# EAGLE schematic Druckluftelektrik (EAGLE 6.5.0)
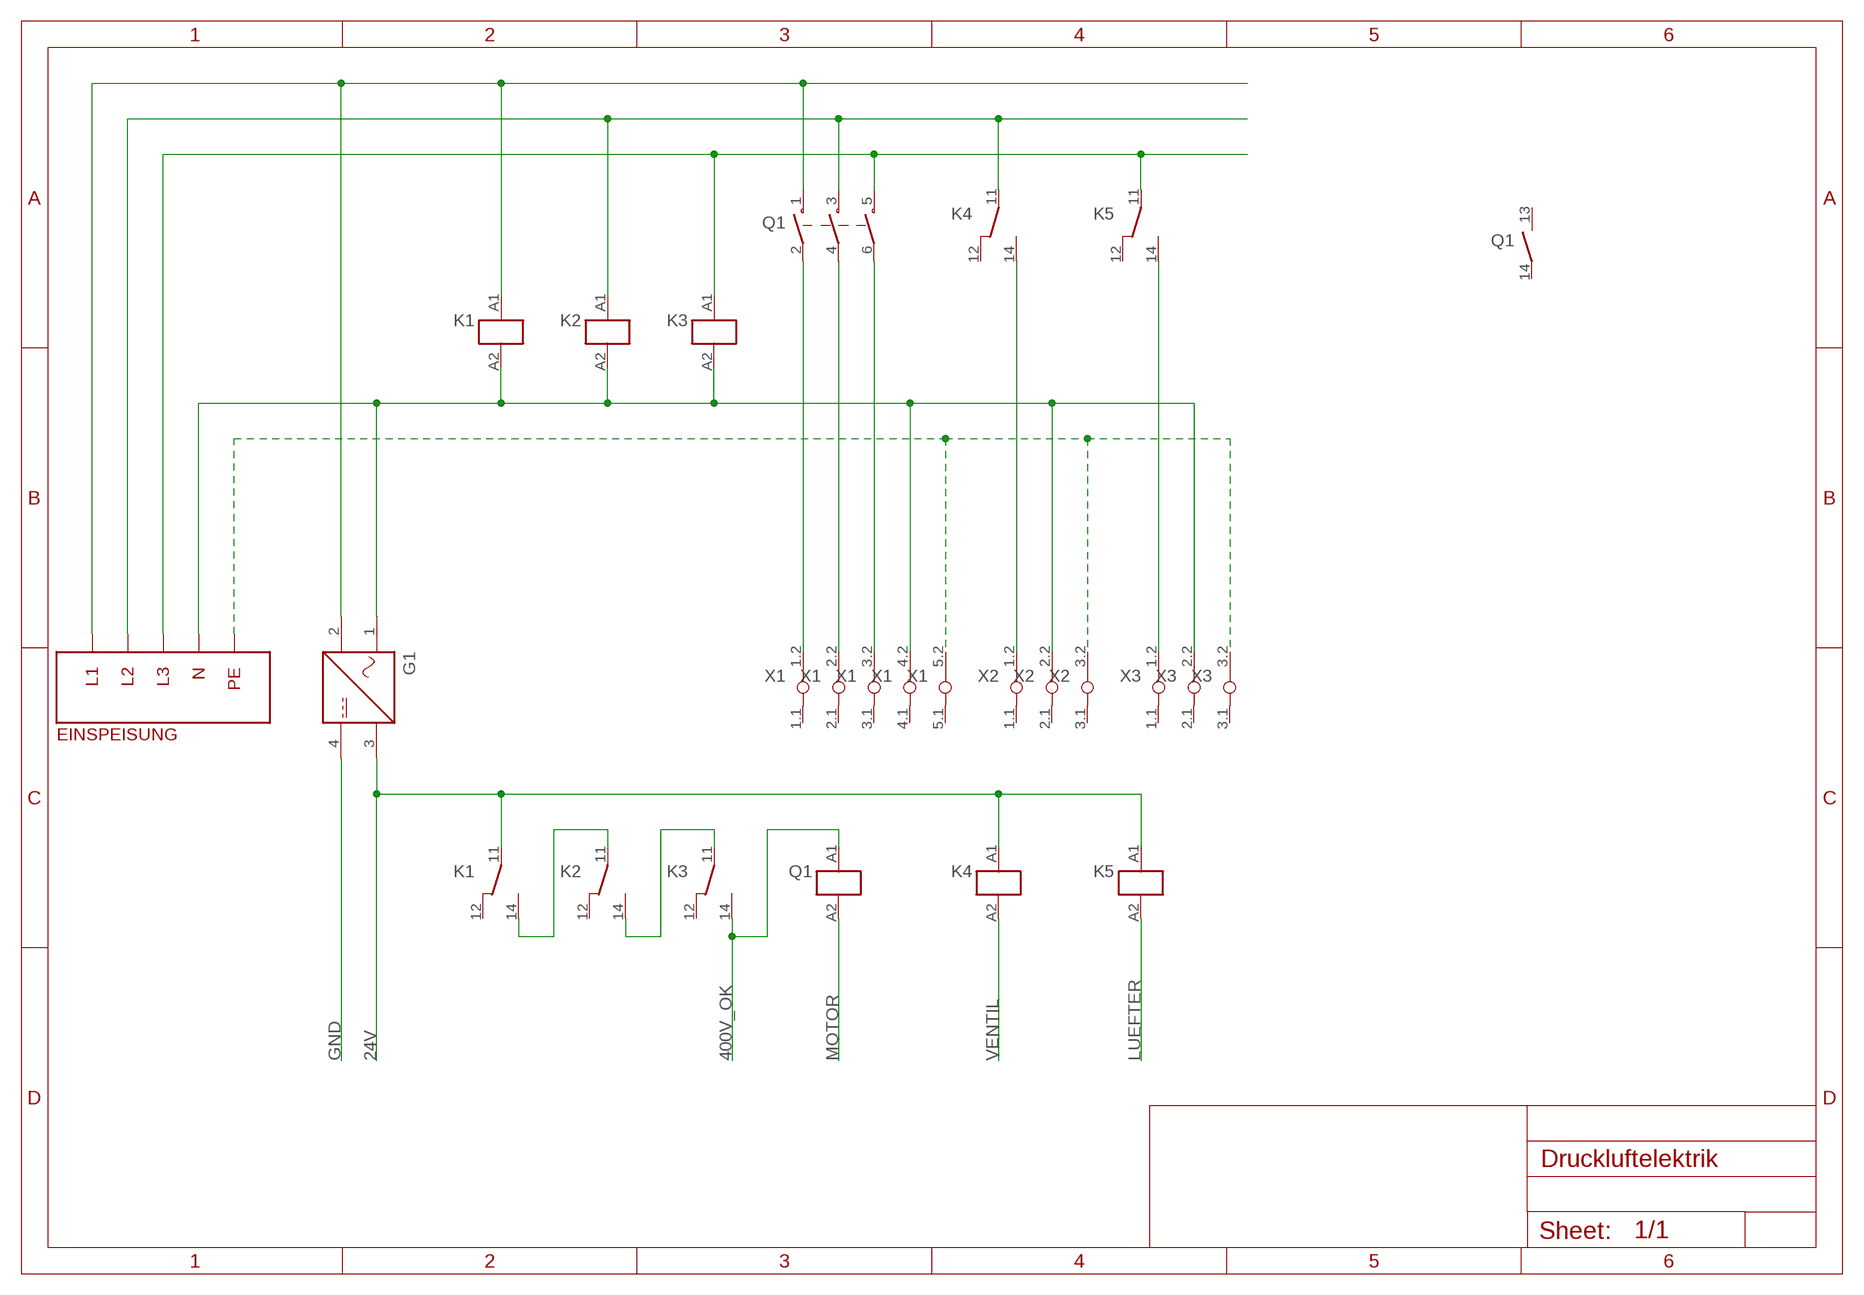
[diagram p0: schematic, sheet 1]

## Parts
G1  NETZTEIL_GLEICHSPANNUNG  [NETZTEIL_GLEICHSPANNUNG]
K1  HILFSSCHUETZ_11-12-14  [HILFSSCHUETZ_11-12-14]
K2  HILFSSCHUETZ_11-12-14  [HILFSSCHUETZ_11-12-14]
K3  HILFSSCHUETZ_11-12-14  [HILFSSCHUETZ_11-12-14]
K4  HILFSSCHUETZ_11-12-14  [HILFSSCHUETZ_11-12-14]
K5  HILFSSCHUETZ_11-12-14  [HILFSSCHUETZ_11-12-14]
Q1  HAUPTSCHUETZ_3-POL_HILFSKONTAKT_13-14  [HAUPTSCHUETZ_3-POL+HILFSKONTAKT_13-14]
X1  KLEMME_1-5  [KLEMME_1-5]
X2  KLEMME_1-3  [KLEMME_1-3]
X3  KLEMME_1-3  [KLEMME_1-3]

## Nets
24V: G1.3 K1.11 K4.A1(0:A1) K5.A1(0:A1)
400V_OK: K3.14 Q1.A1(1:A1)
GND: G1.4
L1-EXT: G1.2 K1.A1(0:A1) Q1.1
L2-EXT: K2.A1(0:A1) K4.11 Q1.3
L3-EXT: K3.A1(0:A1) K5.11 Q1.5
LUEFTER: K5.A2(0:A2)
MOTOR: Q1.A2(1:A2)
N$1: Q1.2 X1.1.2(1:1.2)
N$2: Q1.4 X1.2.2(2:2.2)
N$3: Q1.6 X1.3.2(3:3.2)
N$4: K4.14 X2.1.2(1:1.2)
N$5: K5.14 X3.1.2(1:1.2)
N$7: K1.14 K2.11
N$8: K2.14 K3.11
N-EXT: G1.1 K1.A2(0:A2) K2.A2(0:A2) K3.A2(0:A2) X1.4.2(4:4.2) X2.2.2(2:2.2) X3.2.2(2:2.2)
PE-EXT: X1.5.2(5:5.2) X2.3.2(3:3.2) X3.3.2(3:3.2)
VENTIL: K4.A2(0:A2)
Unconnected: K1.12 K2.12 K3.12 K4.12 K5.12 Q1.13 Q1.14 X1.1.1(1:1.1) X1.2.1(2:2.1) X1.3.1(3:3.1) X1.4.1(4:4.1) X1.5.1(5:5.1) X2.1.1(1:1.1) X2.2.1(2:2.1) X2.3.1(3:3.1) X3.1.1(1:1.1) X3.2.1(2:2.1) X3.3.1(3:3.1)

## Library data of the parts
G1 = e-stromversorgungselemente:NETZTEIL_GLEICHSPANNUNG: Netzteil, Gleichspannung
K1-K5 = e-schuetze-relais:HILFSSCHUETZ_11-12-14: Hilfsschütz mit Wechselkontakt
Q1 = e-schuetze-relais:HAUPTSCHUETZ_3-POL_HILFSKONTAKT_13-14: Hauptschütz 3-pol. mit Hilfskontakt-Schließer
X1 = e-klemmen:KLEMME_1-5: Klemme 5 Pol.
X2 X3 = e-klemmen:KLEMME_1-3: Klemme 3 Pol.